# EAGLE design clvHd_EMG (EAGLE 9.6.2)
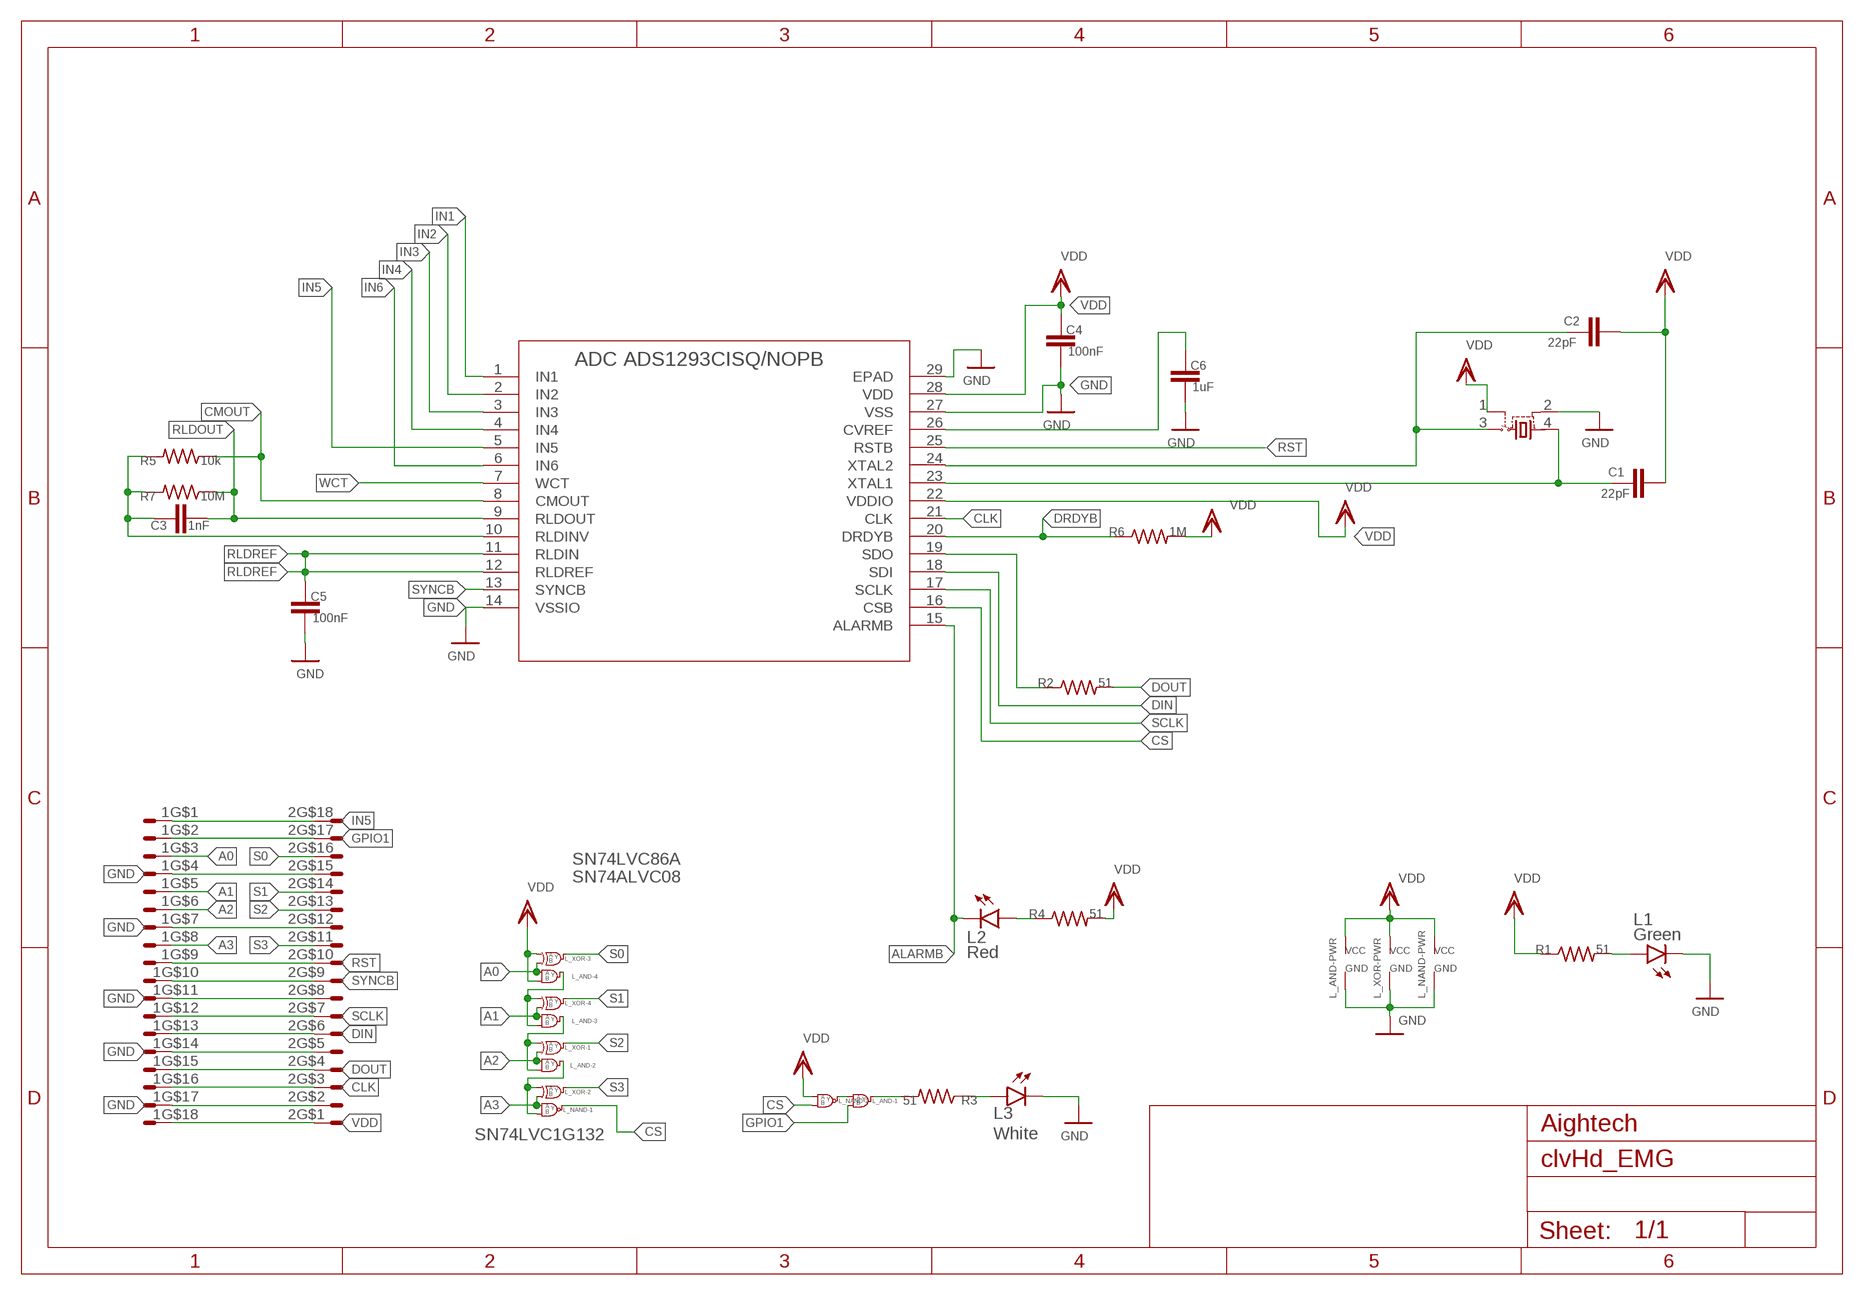
[diagram p0: schematic, sheet 1]

## Parts
1  X05C2018TZ  [X05C2018TZ]
2  X05C2018TZ  [X05C2018TZ]
ADC  ADS1293CISQ/NOPB  [RSG28_3P6X3P6_TEX]
C1  22pF  C-EUC0402  [C0402]
C2  22pF  C-EUC0402  [C0402]
C3  1nF  C-EUC0402  [C0402]
C4  100nF  C-EUC0402  [C0402]
C5  100nF  C-EUC0402  [C0402]
C6  1uF  C-EUC0402  [C0402]
L1  Green  LEDCHIP-LED0603  [CHIP-LED0603]
L2  Red  LEDCHIP-LED0603  [CHIP-LED0603]
L3  White  LEDCHIP-LED0603  [CHIP-LED0603]
L_AND  SN74ALVC08  SN74ALVC08RGY-LARGE  [VQFN-14-CUSTOM]
L_NAND  SN74AUP2G00  SN74AUP2G00DCU  [VSSOP]
L_XOR  SN74LVC86  SN74LVC86ARGY-LARGE  [VQFN-14-CUSTOM]
R1  51  R-US_R0402  [R0402]
R2  51  R-US_R0402  [R0402]
R3  51  R-US_R0402  [R0402]
R4  51  R-US_R0402  [R0402]
R5  10k  R-US_R0402  [R0402]
R6  1M  R-US_R0402  [R0402]
R7  10M  R-US_R0402  [R0402]
TAL  C387328  C387328  [SMD-3225_4P]

## Nets
A0: 1.3 L_AND.12(-4:A) L_XOR.10(-3:B)
A1: 1.5 L_AND.9(-3:A) L_XOR.13(-4:B)
A2: 1.6 L_AND.4(-2:A) L_XOR.2(-1:B)
A3: 1.8 L_NAND.1(-1:A) L_XOR.5(-2:B)
ALARMB: ADC.15(ALARMB) L2.C
CLK: 1.16 2.3 ADC.21(CLK)
CMOUT: ADC.8(CMOUT) R5.1
CS: ADC.16(CSB) L_NAND.6(-2:B) L_NAND.7(-1:Y)
DIN: 1.13 2.6 ADC.18(SDI)
DOUT: 1.15 2.4 R2.2
DRDYB: ADC.20(DRDYB) R6.1
GND: 1.4 1.7 1.11 1.14 1.17 2.2 2.5 2.8 2.12 2.15 ADC.14(VSSIO) ADC.27(VSS) ADC.29(EPAD) C4.2 C5.2 C6.2 L1.C L3.C L_AND.7(-PWR:GND) L_AND.15(-PWR:GND) L_NAND.4(-PWR:GND) L_XOR.7(-PWR:GND) L_XOR.15(-PWR:GND) TAL.2(GND)
GPIO1: 1.2 2.17 L_AND.2(-1:B)
IN1: ADC.1(IN1)
IN2: ADC.2(IN2)
IN3: ADC.3(IN3)
IN4: ADC.4(IN4)
IN5: 1.1 2.18 ADC.5(IN5)
IN6: ADC.6(IN6)
N$1: L_AND.1(-1:A) L_NAND.3(-2:Y)
N$2: L1.A R1.2
N$3: ADC.19(SDO) R2.1
N$4: ADC.23(XTAL1) C1.2 TAL.4(VDD)
N$5: L_AND.3(-1:Y) R3.2
N$6: L2.A R4.1
N$7: L3.A R3.1
N$8: ADC.24(XTAL2) C2.2 TAL.3(OUT)
N$9: ADC.26(CVREF) C6.1
N$11: L_AND.10(-3:B) L_AND.11(-4:Y) L_XOR.12(-4:A)
N$13: L_AND.5(-2:B) L_AND.8(-3:Y) L_XOR.1(-1:A)
N$15: ADC.10(RLDINV) C3.1 R5.2 R7.2
N$16: L_AND.6(-2:Y) L_NAND.2(-1:B) L_XOR.4(-2:A)
RLDOUT: ADC.9(RLDOUT) C3.2 R7.1
RLDREF: ADC.11(RLDIN) ADC.12(RLDREF) C5.1
RST: 1.9 2.10 ADC.25(RSTB)
S0: 2.16 L_XOR.8(-3:Y)
S1: 2.14 L_XOR.11(-4:Y)
S2: 2.13 L_XOR.3(-1:Y)
S3: 2.11 L_XOR.6(-2:Y)
SCLK: 1.12 2.7 ADC.17(SCLK)
SYNCB: 1.10 2.9 ADC.13(SYNCB)
VDD: 1.18 2.1 ADC.22(VDDIO) ADC.28(VDD) C1.1 C2.1 C4.1 L_AND.13(-4:B) L_AND.14(-PWR:VCC) L_NAND.5(-2:A) L_NAND.8(-PWR:VCC) L_XOR.9(-3:A) L_XOR.14(-PWR:VCC) R1.1 R4.2 R6.2 TAL.1(TRI)
WCT: ADC.7(WCT)

## Notes on the sheet
- SN74LVC86A
- SN74ALVC08
- Aightech
- SN74LVC1G132

## Library data of the parts
1 2 = con-omron:X05C2018TZ
ADC = ADS:ADS1293CISQ/NOPB; BUILT_BY: EMA_UL_Team; MANUFACTURER_PART_NUMBER: ADS1293CISQ/NOPB; SOURCELIBRARY: TI_2016-05-20; VENDOR: Texas Instruments
C1-C6 = rcl:C-EU: CAPACITOR, European symbol; SPICEPREFIX: C
L1-L3 = led:LED: LED OSRAM: - CHIPLED LG R971, LG N971, LY N971, LG Q971, LY Q971, LO R971, LY R971 LH N974, LH R974 LS Q976, LO Q976, LY Q976 LO Q996 - Hyper CHIPLED LW Q18S LB Q993, LB Q99A, LB R99A - SideLED LS A670, LO A670, LY A670, LG A670, LP A670 LB A673, LV A673, LT A673, LW A673 LH A674 LY A675 LS A676, LA A676, LO A676, LY A676, LW A676 LS A679, LY A679, LG A679 - Hyper Micro SIDELED® LS Y876, LA Y876, LO Y876, LY Y876 LT Y87S - SmartLED LW L88C, LW L88S LB L89C, LB L89S, LG L890 LS L89K, LO L89K, LY L89K LS L896, LA L896, LO L896, LY L896 - TOPLED LS T670, LO T670, LY T670, LG T670, LP T670 LSG T670, LSP T670, LSY T670, LOP T670, LYG T670 LG T671, LOG T671, LSG T671 LB T673, LV T673, LT T673, LW T673 LH T674 LS T676, LA T676, LO T676, LY T676, LB T676, LH T676, LSB T676, LW T676 LB T67C, LV T67C, LT T67C, LS T67K, LO T67K, LY T67K, LW E67C LS E67B, LA E67B, LO E67B, LY E67B, LB E67C, LV E67C, LT E67C LW T67C LS T679, LY T679, LG T679 LS T770, LO T770, LY T770, LG T770, LP T770 LB T773, LV T773, LT T773, LW T773 LH T774 LS E675, LA E675, LY E675, LS T675 LS T776, LA T776, LO T776, LY T776, LB T776 LHGB T686 LT T68C, LB T68C - Hyper Mini TOPLED® LB M676 - Mini TOPLED Santana® LG M470 LS M47K, LO M47K, LY M47K Source: http://www.osram.convergy.de LUXEON: - LUMILED® LXK2-PW12-R00, LXK2-PW12-S00, LXK2-PW14-U00, LXK2-PW14-V00 LXK2-PM12-R00, LXK2-PM12-S00, LXK2-PM14-U00 LXK2-PE12-Q00, LXK2-PE12-R00, LXK2-PE12-S00, LXK2-PE14-T00, LXK2-PE14-U00 LXK2-PB12-K00, LXK2-PB12-L00, LXK2-PB12-M00, LXK2-PB14-N00, LXK2-PB14-P00, LXK2-PB14-Q00 LXK2-PR12-L00, LXK2-PR12-M00, LXK2-PR14-Q00, LXK2-PR14-R00 LXK2-PD12-Q00, LXK2-PD12-R00, LXK2-PD12-S00 LXK2-PH12-R00, LXK2-PH12-S00 LXK2-PL12-P00, LXK2-PL12-Q00, LXK2-PL12-R00 Source: www.luxeon.com KINGBRIGHT: KA-3528ASYC Source: www.kingbright.com
L_AND = SamacSys_Parts:SN74ALVC08
L_NAND = 1persoLib:SN74AUP2G00: LOW-POWER DUAL 2-INPUT POSITIVE-NAND GATE Source: Datasheet <http://www.ti.com/lit/gpn/sn74aup2g00>
L_XOR = SamacSys_Parts:SN74LVC86A
R1-R5 R7 = rcl:R-US_: RESISTOR, American symbol; SPICEPREFIX: R
R6 = rclCustom:R-US_: RESISTOR, American symbol; SPICEPREFIX: R
TAL = crystalCustom:C387328: 3.3Vdc CMOS SMD CRYSTAL CLOCK OSCILLATOR SOurce: www.abracon.com; OC_FARNELL: unknown; OC_NEWARK: unknown

## Board
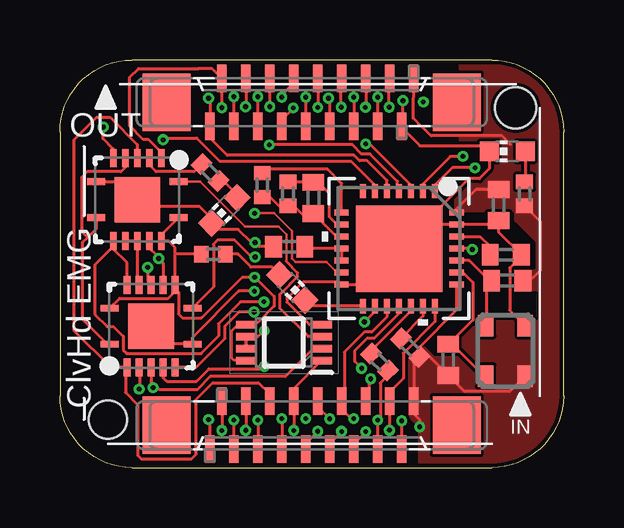
[diagram p1: board, top side]
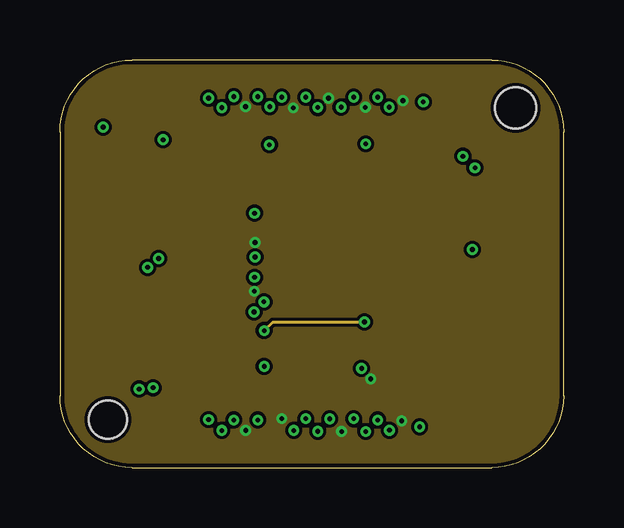
[diagram p2: board, inner layer Route2]
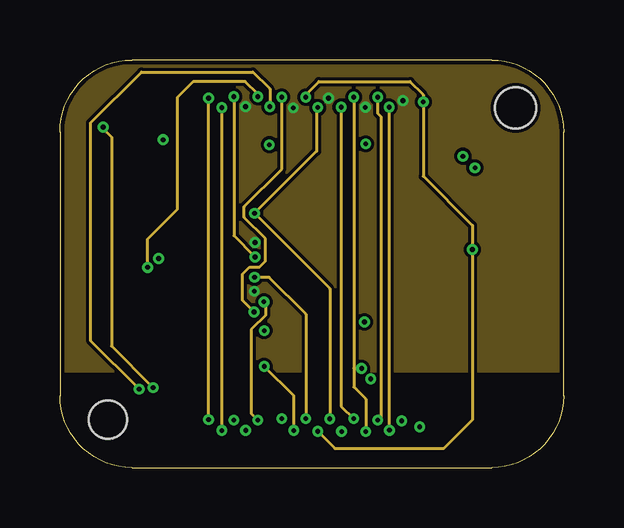
[diagram p3: board, inner layer Route15]
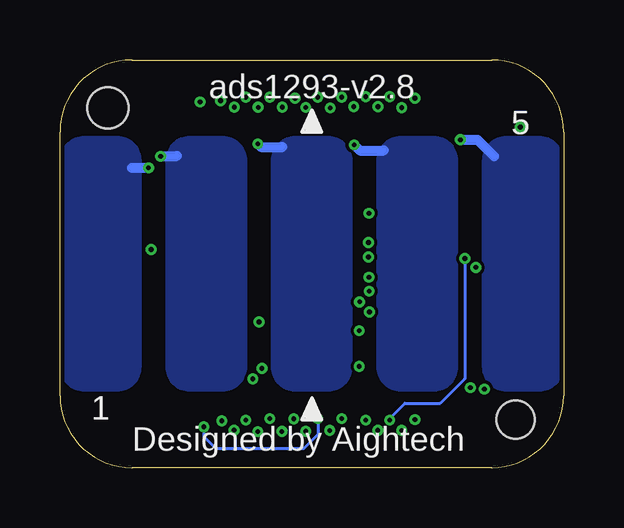
[diagram p4: board, bottom side, seen from below]

Size 21 x 17 mm. Coordinates in mm from the lower left corner, seen from the top.
Outline: 0,14 0,3 arc90 3,0 18,0 arc90 21,3 21,14 arc90 18,17 3,17 arc90 0,14
Copper layers (1*2*15*16): Top 0.035559375mm / dielectric 0.47751875mm / Route2 0.035559375mm / dielectric 0.47751875mm / Route15 0.035559375mm / dielectric 0.47751875mm / Bottom 0.035559375mm
Design rules "SparkFun-4-Layer-Minimum-JLCPCB *": minimum track width 3.5mil, minimum drill 0.2mm, track to track 5mil, track to pad 5mil, pad to pad 5mil, via to via 5mil, smd to smd 5mil, copper to edge 7mil, drill to drill 7mil, minimum pad ring 5mil, minimum via ring 5mil, stop-mask expansion 2.5mil, vias tented up to drill 25mil, thermal gap 10mil
Holes 1.6 mm at 2,2
Holes 1.7 mm at 19,15

### Footprints (pad centres in the part's own frame; a part is rotated, then mirrored left to right if it is on the bottom)
X05C2018TZ = smd 1.15 x 0.4: 1 -1,4.25; 2 1,3.75; 3 -1,3.25; 4 1,2.75; 5 -1,2.25; 6 1,1.75; 7 -1,1.25; 8 1,0.75; 9 -1,0.25; 10 1,-0.25; 11 -1,-0.75; 12 1,-1.25; 13 -1,-1.75; 14 1,-2.25; 15 -1,-2.75; 16 1,-3.25; 17 -1,-3.75; 18 1,-4.25 | smd 2.4 x 2: M1 0,6.05; M2 0,-6.05
RSG28_3P6X3P6_TEX = smd 0.6 x 0.25: 1 -2.4,1.5; 2 -2.4,1; 3 -2.4,0.5; 4 -2.4,0; 5 -2.4,-0.5; 6 -2.4,-1; 7 -2.4,-1.5; 15 2.4,-1.5; 16 2.4,-1; 17 2.4,-0.5; 18 2.4,0; 19 2.4,0.5; 20 2.4,1; 21 2.4,1.5 | smd 0.25 x 0.6: 8 -1.5,-2.4; 9 -1,-2.4; 10 -0.5,-2.4; 11 0,-2.4; 12 0.5,-2.4; 13 1,-2.4; 14 1.5,-2.4; 22 1.5,2.4; 23 1,2.4; 24 0.5,2.4; 25 0,2.4; 26 -0.5,2.4; 27 -1,2.4; 28 -1.5,2.4 | smd 3.6 x 3.6: 29 0,0
C0402 = smd 0.7 x 0.9: 1 -0.65,0; 2 0.65,0
CHIP-LED0603 = smd 0.8 x 0.8: A 0,-0.75; C 0,0.75
VQFN-14-CUSTOM = smd 0.75 x 0.28: 1 -1.725,-0.75; 7 1.725,-0.75; 8 1.725,0.75; 14 -1.725,0.75 | smd 0.28 x 0.75: 2 -1,-1.725; 3 -0.5,-1.725; 4 0,-1.725; 5 0.5,-1.725; 6 1,-1.725; 9 1,1.725; 10 0.5,1.725; 11 0,1.725; 12 -0.5,1.725; 13 -1,1.725 | smd 1.9 x 1.9: 15 0,0
VSSOP = smd 0.85 x 0.3: 1 -1.575,0.75; 2 -1.575,0.25; 3 -1.575,-0.25; 4 -1.575,-0.75; 5 1.575,-0.75; 6 1.575,-0.25; 7 1.575,0.25; 8 1.575,0.75
R0402 = smd 0.6 x 0.7: 1 -0.5,0; 2 0.5,0
R0402' = smd 0.6 x 0.7: 1 -0.55,0; 2 0.55,0
SMD-3225_4P = smd 0.9 x 0.65: 1 -1.05,-0.825; 2 1.05,-0.825; 3 1.05,0.825; 4 -1.05,0.825

### Placement (x,y rotation side)
1  10.5,1.77 90 top
2  10.5,15.23 270 top
ADC  14.14,9.13 270 top
C1  16.19,4.5 90 top
C2  18.65,7.8 180 top
C3  10.57,11.25 90 top
C4  18.29,10.95 270 top
C5  9.56,9.21 180 top
C6  18.59,8.88 0 top
L1  18.65,13.19 90 top
L2  9.69,7.51 225 top
L3  6.85,10.72 135 top
L_AND  3.23,11.18 180 top
L_NAND  9.34,5.21 180 top
L_XOR  3.8,5.9 0 top
R1  19.37,11.41 90 top
R2  13.32,4.4 315 top
R3  6.26,12.3 135 top
R4  6.4,8.9 180 top
R5  8.44,11.78 270 top
R6  1M  [R0402']  14.6,5 315 top
R7  9.51,11.42 270 top
TAL  18.57,4.87 90 top

### Tracks (layer width: path | path; a pad name or v marks a point on that pad's centre or on a via)
A0  (via drill 0.2)
  Top 0.127: L_XOR.10 4.3,8.53 v4.11,8.72 4.05,8.72 4.05,8.84 3.73,9.16 L_AND.12 | 1.3 v7.25,1.98
  Bottom 0.127: v4.11,8.72 v4.12,8.71 4.12,3.7 5.14,2.68 6.62,2.68 7.25,2.05 v7.25,1.98
A1  (via drill 0.2)
  Top 0.127: L_XOR.13 2.8,8.55 2.23,9.12 2.23,9.22 | L_AND.9 2.23,9.22 | 2.23,9.22 1.45,8.45 1.45,6.39 1.96,5.88 2.23,5.88 2.64,5.47 2.64,4.89 2.77,4.76 5.89,4.76 6.61,5.48 6.61,6 7.52,6.91 v8.5,6.91 | v8.25,1.98 8.25,1.01 8.25,1 1.5
  Route15 0.127: v8.5,6.91 8.59,6.83 8.59,6.37 7.97,5.75 7.97,2.26 v8.25,1.98
A2
  Top 0.127: L_AND.4 3.23,13.47 2.08,14.61 1.53,14.61 0.6,13.68 0.6,5.7 2.12,4.17 L_XOR.2 2.73,4.11 2.73,3.12 3.24,2.61 3.24,0.51 3.38,0.37 5.49,0.37 5.68,0.56 5.68,2.85 6.37,3.54 8.28,3.54 8.75,3.07 1.6
A3  (via drill 0.2)
  Top 0.127: L_XOR.5 4.3,3.75 4.45,3.6 5.69,3.6 6.21,4.12 8.42,4.12 v8.52,4.22 | L_NAND.1 9.7,3.25 9.75,3.25 1.8 v9.75,1.55
  Route15 0.127: v9.75,1.55 9.75,2.99 v8.52,4.22
ALARMB
  Top 0.127: ADC.15 10.47,6.73 L2.C
CLK  (via drill 0.2)
  Top 0.127: ADC.21 15.64,6.09 14.32,4.77 14.32,3.72 13.75,3.15 1.16 13.75,1.57 v13.74,1.56 | v13.73,15.03 13.73,16.21 2.3
  Route15 0.127: v13.73,15.03 13.73,1.55 v13.74,1.56
CMOUT
  Top 0.127: ADC.8 11.74,11.85 11.15,12.44 8.6,12.44 R5.1
CS  (via drill 0.2)
  Top 0.127: ADC.16 13.14,6.51 v12.7,6.07 | v8.52,5.71 v8.51,5.71 8.26,5.46 L_NAND.6
  Top 0.152: L_NAND.7 L_NAND.6
  Route2 0.127: v8.52,5.71 8.88,6.07 v12.7,6.07
DIN  (via drill 0.2)
  Top 0.127: ADC.18 14.14,6.43 13.1,5.39 12.81,5.39 12.3,4.88 12.3,4.42 v12.58,4.14 | v12.75,1.5 12.25,1 1.13 | v12.25,15.45 2.6
  Route15 0.127: v12.25,15.45 12.25,4.14 | 12.25,4.14 12.25,3.36 12.75,2.86 v12.75,1.5 | v12.58,4.14 12.25,4.14
DOUT  (via drill 0.2)
  Top 0.127: R2.2 13.67,3.84 13.36,3.52 13.36,2.09 v13.25,1.98 1.15 | 2.4 v13.25,15.45
  Route15 0.127: v13.25,15.45 v13.24,15.44 13.24,14.78 13.38,14.64 13.38,2.1 v13.26,1.98 v13.25,1.98
DRDYB
  Top 0.127: ADC.20 15.14,6.32 R6.1
GND  (via drill 0.2)
  Top 0.127: C6.2 19.24,9.25 | ADC.29 15.14,10.13 ADC.27 18.12,10.13 C4.2 18.29,9.83 C6.2 | ADC.29 12.64,7.63 ADC.14 11.63,7.74 10.14,7.74 9.46,7.06 9.46,6.9 10.4,5.96 L_NAND.4 | ADC.29 17.06,12.05 17.49,12.05 17.9,12.46 L1.C 17.66,13.43 15.01,13.43 14.25,14.18 2.2 14.3,14.28 v14.3,15.3 | L_AND.7 2.48,11.93 L_AND.15 3.49,10.9 5.8,10.9 6.32,10.39 L3.C 6.58,9.93 7.43,9.93 7.98,9.38 v8.14,9.38 8.31,9.21 C5.2 | L_XOR.15 4.55,5.15 L_XOR.7 5.53,5.42 7.46,7.36 v8.11,7.36 | 1.4 v7.75,1.55 | v9.25,2.04 1.7 | 1.11 11.25,1 v11.75,1.5 | 1.14 12.89,2.92 12.89,3.63 v12.96,3.7 | 1.17 v14.25,1.95 | 2.15 v7.75,15.05 v7.74,15.05 | 2.12 9.25,14.52 v9.73,15 | 2.8 11.25,15.35 v11.2,15.4 | 2.5 12.75,15.05 12.7,15 12.71,15 v12.73,15.02 | C6.2 19.24,8.81 18.76,8.33 18.76,6.56 TAL.2
  pour Route2: 0,17 21,17 21,0 0,0
  pour Route15: 0,4.01 0,17 21,17 21,4.01
GPIO1  (via drill 0.2)
  Top 0.127: L_AND.2 4.21,12.92 4.21,13.17 3.69,13.69 3.47,13.69 2.9,14.26 2.9,16.27 3.27,16.64 5.78,16.64 6.34,16.64 2.17 v6.75,15.01 | 1.2 v6.75,1.55
  Route15 0.127: v6.75,1.55 v6.75,15.01
IN1  (via drill 0.2)
  Top 0.127: ADC.1 15.64,11.79 16.36,12.51 v17.3,12.51 v17.31,12.5
  Bottom 0.406: v17.31,12.5 17.99,12.5
  pour Bottom: 17.6,4.2 17.6,12.8 arc-90 18.6,13.8 20,13.8 arc-90 21,12.8 21,4.2 arc-90 20,3.2 18.6,3.2 arc-90
IN2  (via drill 0.2)
  Top 0.127: v16.8,12.98 v16.79,12.97 16.28,12.97 15.14,11.83 ADC.2
  Bottom 0.406: v16.8,12.98 v16.79,12.99 16.12,12.99
  pour Bottom: 13.2,4.2 13.2,12.8 arc-90 14.2,13.8 15.6,13.8 arc-90 16.6,12.8 16.6,4.2 arc-90 15.6,3.2 14.2,3.2 arc-90
IN3  (via drill 0.2)
  Top 0.127: ADC.3 14.64,11.78 12.92,13.5 v12.75,13.5
  Bottom 0.406: v12.75,13.5 12.62,13.37 11.72,13.37
  pour Bottom: 8.8,4.2 8.8,12.8 arc-90 9.8,13.8 11.2,13.8 arc-90 12.2,12.8 12.2,4.2 arc-90 11.2,3.2 9.8,3.2 arc-90
IN4  (via drill 0.2)
  Top 0.127: ADC.4 14.08,11.53 14.08,11.93 12.93,13.08 12.57,13.08 12.19,13.46 v8.73,13.46
  Bottom 0.406: v8.73,13.46 8.49,13.22 7.5,13.22
  pour Bottom: 4.4,4.2 4.4,12.8 arc-90 5.4,13.8 6.8,13.8 arc-90 7.8,12.8 7.8,4.2 arc-90 6.8,3.2 5.4,3.2 arc-90
IN5  (via drill 0.2)
  Top 0.127: ADC.5 13.64,11.97 12.81,12.8 12.49,12.8 12.26,13.03 6.97,13.03 6.25,13.75 2.18 6.25,15.35 v6.2,15.4 | 1.1 6.25,1.95 v6.2,2
  Route15 0.127: v6.2,2 v6.2,15.4
IN6  (via drill 0.2)
  Top 0.127: ADC.6 13.14,11.78 12.15,12.77 6.68,12.77 5.7,13.75 4.38,13.75 v4.3,13.67
  Bottom 0.406: v4.3,13.67 3.59,13.67 2.89,12.97
  pour Bottom: 0,4.2 0,12.8 arc-90 1,13.8 2.4,13.8 arc-90 3.4,12.8 3.4,4.2 arc-90 2.4,3.2 1,3.2 arc-90
N$1
  Top 0.1: L_AND.1 5.84,11.93 7.72,10.05 9.11,10.05 9.44,9.72 9.44,8.62
  Top 0.127: L_NAND.3 10.36,5.46 9.19,6.63 9.19,7.25 9.22,7.28 9.24,7.28 9.92,7.96 9.92,8.12 9.44,8.6 9.44,8.62
N$2
  Top 0.127: L1.A 19.4,11.94 R1.2
N$3
  Top 0.127: ADC.19 14.64,6.54 12.97,4.87
  Top 0.152: 12.97,4.87 R2.1
N$4
  Top 0.127: ADC.23 16.81,8.13 17.22,7.72 17.22,6.15 16.22,5.15 C1.2 16.35,5.15 17.68,3.82 TAL.4
N$5
  Top 0.127: R3.2 5.59,12.34 4.01,12.34 3.69,12.65 3.69,12.87 L_AND.3
N$6
  Top 0.127: L2.A 8.84,8.36 7.96,8.36 7.42,8.9 R4.1
N$7
  Top 0.127: R3.1 6.82,11.95 7.38,11.39 L3.A
N$8
  Top 0.127: ADC.24 17.07,8.63 17.9,7.8 C2.2 17.79,7.59 17.79,5.96 TAL.3
N$9
  Top 0.127: ADC.26 17.52,9.63 17.94,9.21 C6.1
N$11
  Top 0.127: L_AND.10 L_AND.11 3.23,7.7 L_XOR.12
N$13
  Top 0.127: 1.15,9.6 0.95,9.4 0.95,6.17 1.98,5.15 L_XOR.1 | 1.15,9.6 1.5,9.95 L_AND.8 | 1.15,9.6 0.9,9.85 0.9,12.1 1.14,12.34 2.54,12.34 2.76,12.55 2.76,12.87 L_AND.5
N$15
  Top 0.127: R5.2 8.76,11.28 9.13,10.91 R7.2 9.73,10.92 10.25,10.4 10.37,10.4 C3.1 11.54,9.63 ADC.10
N$16  (via drill 0.2)
  Top 0.127: L_AND.6 2.23,13.29 1.8,13.71 v1.8,14.19 | L_XOR.4 3.8,3.6 | 3.8,3.6 3.8,3.42 v3.88,3.33 | 3.8,3.6 4.15,3.25 5.72,3.25 6.26,3.79 9.4,3.79 10.57,4.96 L_NAND.2
  Route15 0.127: v3.88,3.33 2.15,5.07 2.15,13.79 1.8,14.14 v1.8,14.19
RLDOUT
  Top 0.127: ADC.9 11.55,10.13 11.22,10.46 11.22,11.44 10.76,11.9 C3.2 9.53,11.9 R7.1
RLDREF
  Top 0.127: ADC.12 ADC.11 10.29,9.13 C5.1
RST  (via drill 0.2)
  Top 0.127: v17.2,9.1 17.17,9.13 ADC.25 | 1.9 10.24,1 v10.75,1.51 | 2.10 v10.25,15.45
  Route15 0.127: v10.25,15.45 10.25,15.55 10.8,16.1 14.6,16.1 15.15,15.55 v15.15,15.25 15.15,12.15 17.2,10.1 v17.2,9.1 17.2,2 16,0.8 11.46,0.8 v10.75,1.51
S0  (via drill 0.2)
  Top 0.127: L_XOR.8 6.41,7.53 6.41,9.31 6.57,9.48 7.29,9.48 7.99,8.78 v8.14,8.78 | 2.16 v7.25,15.47
  Route15 0.127: v7.25,15.47 7.25,9.67 v8.14,8.78
S1  (via drill 0.2)
  Top 0.127: v3.66,8.35 3.66,7.76 L_XOR.11 | 2.14 v8.25,15.47
  Route15 0.127: v8.25,15.47 8.25,15.57 7.72,16.1 5.56,16.1 4.9,15.44 4.9,10.77 3.66,9.53 v3.66,8.35
S2  (via drill 0.2)
  Top 0.127: L_XOR.3 3.32,4.16 3.32,3.29 v3.3,3.27 | v8.75,15.05 2.13
  Route15 0.127: v3.3,3.27 1.27,5.31 1.27,14.37 3.4,16.5 8.05,16.5 8.75,15.8 v8.75,15.05
S3  (via drill 0.2)
  Top 0.127: v8.09,6.49 7.47,6.49 6.87,5.89 6.87,5.37 5.67,4.17 L_XOR.6 | v9.25,15.45 9.25,15.55 9.75,16.05 2.11
  Route15 0.127: v8.09,6.49 7.6,6.98 7.6,8.05 7.91,8.36 8.32,8.36 8.57,8.61 8.57,9.55 7.68,10.44 7.68,10.88 9.25,12.45 v9.25,15.45
SCLK  (via drill 0.2)
  Top 0.127: ADC.17 13.64,6.29 13,5.65 12.69,5.65 11.86,4.81 11.86,2.88 1.12 11.75,2.45 12.16,2.04 v12.25,2.04 | 2.7 11.8,16.18 11.73,16.11 v11.73,15.03
  Route15 0.127: v11.73,15.03 11.73,2.56 v12.25,2.04
SYNCB  (via drill 0.2)
  Top 0.1: ADC.13 11.56,8.13 11.12,8.57 9.83,8.57 9.68,8.72 9.68,9.86 8.93,10.61 v8.11,10.61
  Top 0.127: 2.9 v10.75,15.02 | 1.10 10.74,2.54 v11.25,2.03
  Route15 0.127: v11.25,2.03 11.25,7.47 v8.11,10.61 10.7,13.2 10.7,14.97 v10.75,15.02
VDD  (via drill 0.2)
  Top 0.1: L_NAND.8
  Top 0.127: C4.1 17.35,11.6 16.54,10.79 ADC.28 | ADC.22 16.54,6.57 14.99,5.02 R6.2 | L_XOR.9 4.8,9.18 4.53,9.45 L_AND.13 4.22,9.7 L_AND.14 | L_XOR.14 2.48,7.06 4.52,7.06 4.78,7.32 4.78,7.61 L_XOR.9 | R4.2 4.8,8.9 L_XOR.9 | L_XOR.9 4.8,7.47 4.94,7.33 4.94,6.41 5.11,6.24 5.9,6.24 7.6,7.94 v8.12,7.94 8.13,7.94 8.93,7.14 8.93,6.73 8.26,6.06 7.9,6.06 7.8,5.96 L_NAND.5 7.73,5.96 7.71,5.94 7.4,5.94 7.14,5.68 7.14,4.59 7.26,4.47 L_NAND.8 | v15,1.7 15,2 14.75,2.25 1.18 14.75,4.37 R6.2 | R6.2 15.43,4.61 C1.1 16.87,3.17 18.75,3.17 TAL.1 | R1.1 19.39,10.91 20.04,10.26 20.04,8.22 19.73,7.91 19.41,7.91 C2.1 19.6,7.8 | 18.79,13.48 18.43,13.84 15.47,13.84 15.11,14.2 15.1,14.2 14.73,14.57 14.73,15.42 14.75,15.44 2.1
  Route15 0.127: v8.12,7.94 8.72,7.94 10.26,6.4 v10.26,2.05 v10.25,2.04
  Bottom 0.127: v15,1.7 15,1.29 14.51,0.8 10.83,0.8 10.25,1.38 v10.25,2.04
  pour Top (no thermals): 15,0 15,1.7 14.6,2.1 14.6,4.6 15,5 15.2,5 15.6,4.6 16.6,4.6 16.8,4.8 16.8,6.1 19.9,6.1 20,6.2 20,7.3 19.9,7.4 19.4,7.4 19.4,8.2 19.8,8.2 19.9,8.3 19.9,9.4 19,10.3 19,10.7 16.4,10.7 16.5,10.8 16.5,11.6 16.7,11.8 16.7,17 21,17 21,1.6 19.4,0

### Text on the board
tNames: OUT | ClvHd EMG | IN
bNames: ads1293-v2.8 | 5 | 1 | Designed by Aightech